# EAGLE design shm (EAGLE 6.4)
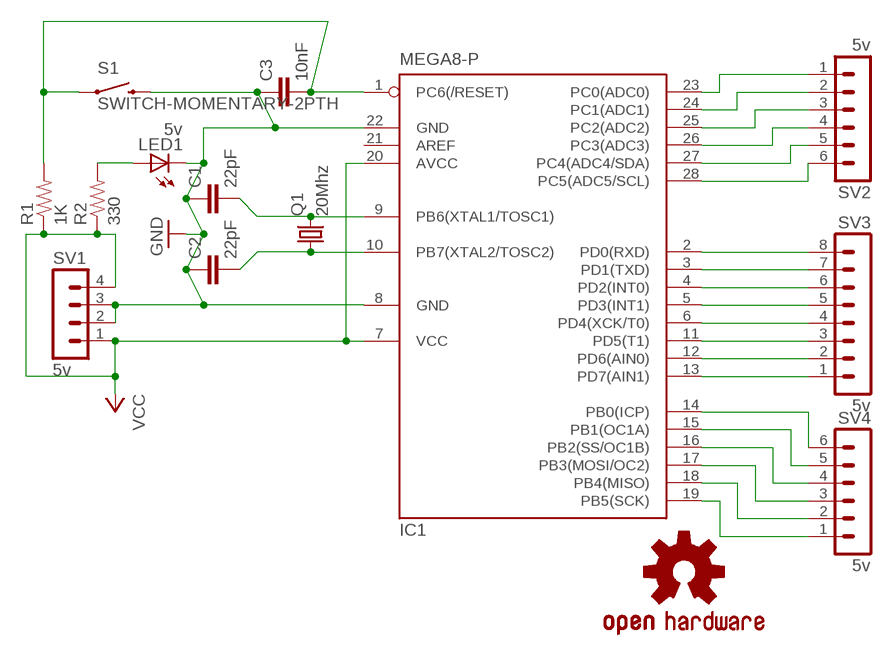
[diagram p0: schematic, sheet 1]

## Parts
C1  22pF  CAP0805  [0805]
C2  22pF  CAP0805  [0805]
C3  10nF  CAP0805  [0805]
IC1  MEGA8-P  [DIL28-3]
LED1  5v  LEDCHIPLED_0805  [CHIPLED_0805]
LOGO1  OSHW-LOGOL  [OSHW-LOGO-L]
Q1  20Mhz  CRYSTALSM49  [SM49]
R1  1K  RESISTOR0805-RES  [0805]
R2  330  RESISTOR0805-RES  [0805]
S1  SWITCH-MOMENTARY-2PTH  [TACTILE-PTH]
SV1  5v  MA04-1  [MA04-1]
SV2  5v  MA06-1  [MA06-1]
SV3  5v  MA08-1  [MA08-1]
SV4  5v  MA06-1  [MA06-1]

## Nets
GND: C1.1 C2.1 C3.1 IC1.8(GND) IC1.22(GND) LED1.C S1.3 SV1.2 SV1.3
N$1: IC1.2(PD0(RXD)) SV3.8
N$2: IC1.3(PD1(TXD)) SV3.7
N$3: IC1.4(PD2(INT0)) SV3.6
N$4: IC1.5(PD3(INT1)) SV3.5
N$5: IC1.6(PD4(XCK/T0)) SV3.4
N$6: IC1.11(PD5(T1)) SV3.3
N$7: IC1.12(PD6(AIN0)) SV3.2
N$8: IC1.13(PD7(AIN1)) SV3.1
N$9: IC1.14(PB0(ICP)) SV4.6
N$10: IC1.15(PB1(OC1A)) SV4.5
N$11: IC1.16(PB2(SS/OC1B)) SV4.4
N$12: IC1.17(PB3(MOSI/OC2)) SV4.3
N$13: IC1.18(PB4(MISO)) SV4.2
N$14: IC1.19(PB5(SCK)) SV4.1
N$15: IC1.28(PC5(ADC5/SCL)) SV2.6
N$16: IC1.27(PC4(ADC4/SDA)) SV2.5
N$17: IC1.26(PC3(ADC3)) SV2.4
N$18: IC1.25(PC2(ADC2)) SV2.3
N$19: IC1.24(PC1(ADC1)) SV2.2
N$20: IC1.23(PC0(ADC0)) SV2.1
N$21: C1.2 IC1.9(PB6(XTAL1/TOSC1)) Q1.2
N$22: LED1.A R2.2
N$23: C2.2 IC1.10(PB7(XTAL2/TOSC2)) Q1.1
N$24: C3.2 IC1.1(PC6(/RESET)) R1.2 S1.1
VCC: IC1.7(VCC) IC1.20(AVCC) R1.1 R2.1 SV1.1 SV1.4
Unconnected: IC1.21(AREF)

## Library data of the parts
C1-C3 = SparkFun-Capacitors:CAP: Capacitor Standard 0603 ceramic capacitor, and 0.1" leaded capacitor.
IC1 = atmel:MEGA8-P: MICROCONTROLLER 8 Kbytes FLASH, 1 kbytes SRAM, 512 bytes EEPROM, USART, 4-channel 10 bit ADC, 2-channel 8 bit ADC Pin compatible with Atmega48, ATMega88, ATMega168 Source: avr.lbr; OC_FARNELL: unknown; OC_NEWARK: unknown
LED1 = led:LED: LED OSRAM: - CHIPLED LG R971, LG N971, LY N971, LG Q971, LY Q971, LO R971, LY R971 LH N974, LH R974 LS Q976, LO Q976, LY Q976 LO Q996 - Hyper CHIPLED LW Q18S LB Q993, LB Q99A, LB R99A - SideLED LS A670, LO A670, LY A670, LG A670, LP A670 LB A673, LV A673, LT A673, LW A673 LH A674 LY A675 LS A676, LA A676, LO A676, LY A676, LW A676 LS A679, LY A679, LG A679 - Hyper Micro SIDELED® LS Y876, LA Y876, LO Y876, LY Y876 LT Y87S - SmartLED LW L88C, LW L88S LB L89C, LB L89S, LG L890 LS L89K, LO L89K, LY L89K LS L896, LA L896, LO L896, LY L896 - TOPLED LS T670, LO T670, LY T670, LG T670, LP T670 LSG T670, LSP T670, LSY T670, LOP T670, LYG T670 LG T671, LOG T671, LSG T671 LB T673, LV T673, LT T673, LW T673 LH T674 LS T676, LA T676, LO T676, LY T676, LB T676, LH T676, LSB T676, LW T676 LB T67C, LV T67C, LT T67C, LS T67K, LO T67K, LY T67K, LW E67C LS E67B, LA E67B, LO E67B, LY E67B, LB E67C, LV E67C, LT E67C LW T67C LS T679, LY T679, LG T679 LS T770, LO T770, LY T770, LG T770, LP T770 LB T773, LV T773, LT T773, LW T773 LH T774 LS E675, LA E675, LY E675, LS T675 LS T776, LA T776, LO T776, LY T776, LB T776 LHGB T686 LT T68C, LB T68C - Hyper Mini TOPLED® LB M676 - Mini TOPLED Santana® LG M470 LS M47K, LO M47K, LY M47K Source: http://www.osram.convergy.de LUXEON: - LUMILED® LXK2-PW12-R00, LXK2-PW12-S00, LXK2-PW14-U00, LXK2-PW14-V00 LXK2-PM12-R00, LXK2-PM12-S00, LXK2-PM14-U00 LXK2-PE12-Q00, LXK2-PE12-R00, LXK2-PE12-S00, LXK2-PE14-T00, LXK2-PE14-U00 LXK2-PB12-K00, LXK2-PB12-L00, LXK2-PB12-M00, LXK2-PB14-N00, LXK2-PB14-P00, LXK2-PB14-Q00 LXK2-PR12-L00, LXK2-PR12-M00, LXK2-PR14-Q00, LXK2-PR14-R00 LXK2-PD12-Q00, LXK2-PD12-R00, LXK2-PD12-S00 LXK2-PH12-R00, LXK2-PH12-S00 LXK2-PL12-P00, LXK2-PL12-Q00, LXK2-PL12-R00 Source: www.luxeon.com KINGBRIGHT: KA-3528ASYC Source: www.kingbright.com
LOGO1 = SparkFun-Aesthetics:OSHW-LOGO: Open Source Hardware Logo This logo indicates the piece of hardware it is found on incorporates a OSHW license and/or adheres to the definition of open source hardware found here: http://freedomdefined.org/OSHW
Q1 = crystal:CRYSTAL: CRYSTAL; OC_FARNELL: unknown; OC_NEWARK: unknown
R1 R2 = SparkFun-Passives:RESISTOR: Resistor Basic schematic elements and footprints for 0603, 1206, and PTH resistors.
S1 = SparkFun-Electromechanical:SWITCH-MOMENTARY-2: Various NO switches- pushbuttons, reed, etc
SV1 = con-lstb:MA04-1: PIN HEADER; OC_FARNELL: unknown; OC_NEWARK: unknown
SV2 SV4 = con-lstb:MA06-1: PIN HEADER; OC_FARNELL: unknown; OC_NEWARK: unknown
SV3 = con-lstb:MA08-1: PIN HEADER; OC_FARNELL: unknown; OC_NEWARK: unknown

## Board
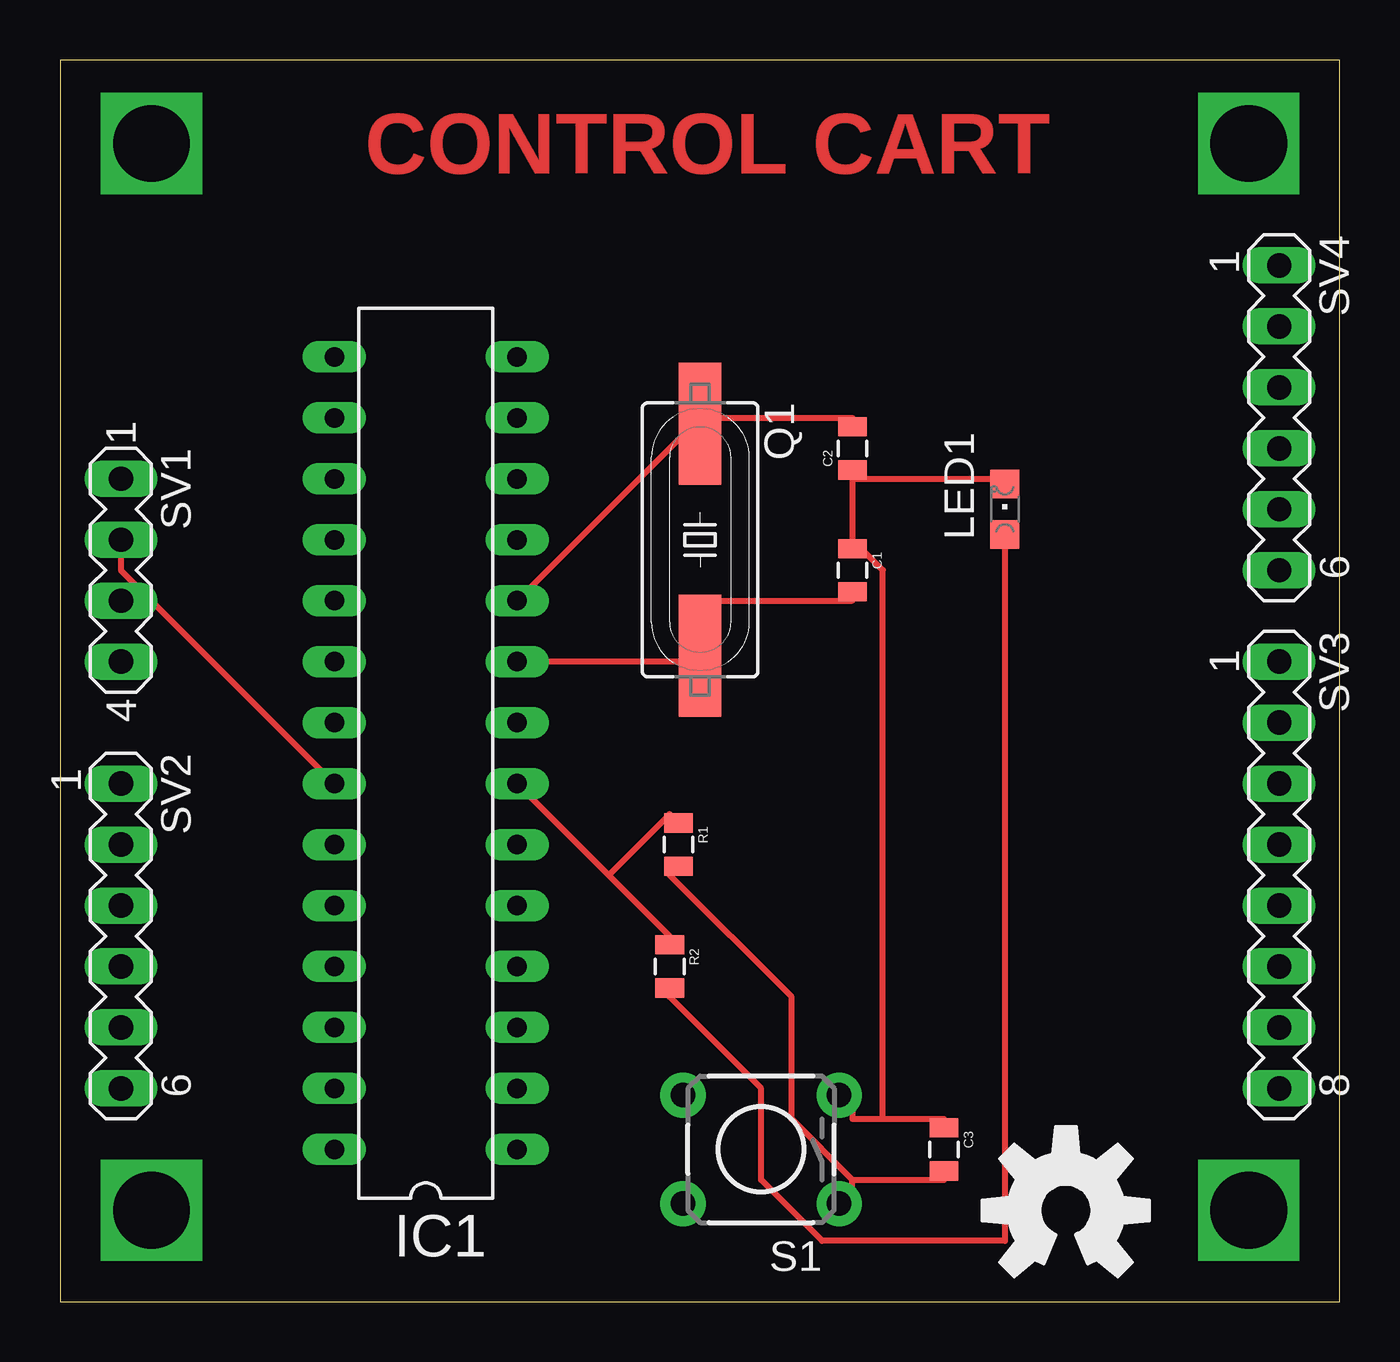
[diagram p1: board, top side]
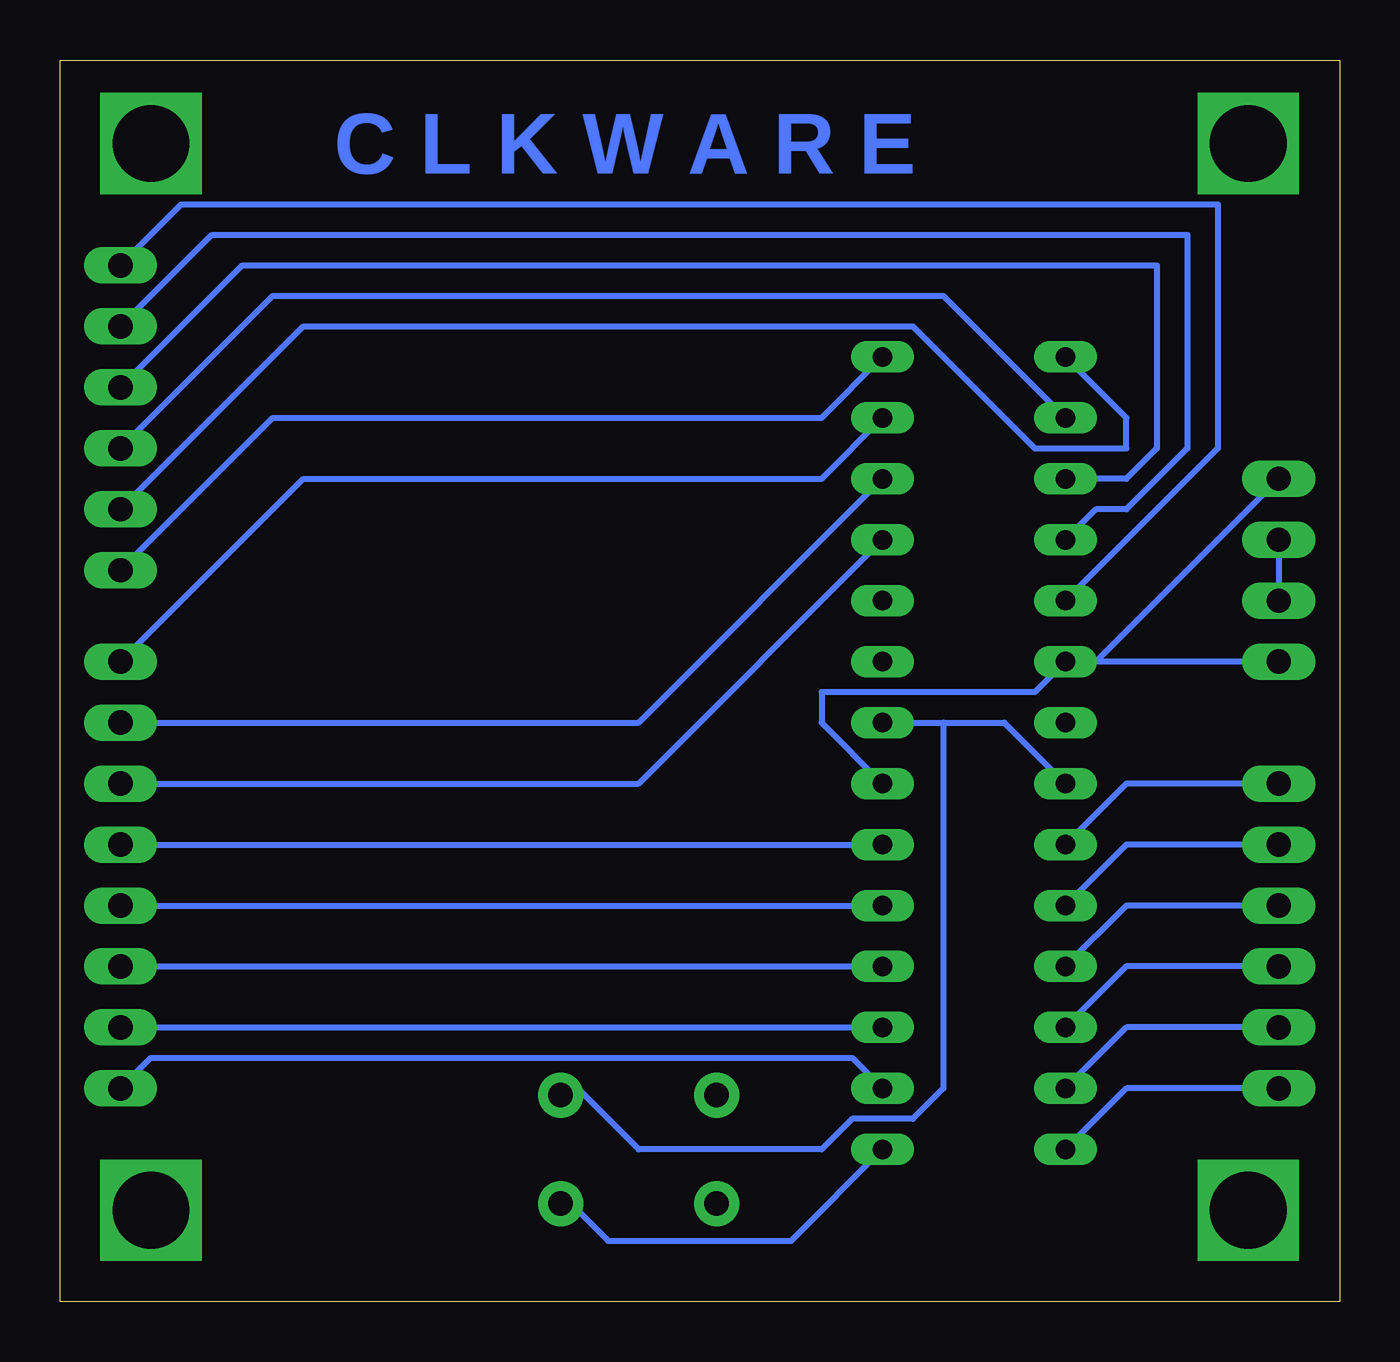
[diagram p2: board, bottom side, seen from below]

Size 53.32 x 51.74 mm. Coordinates in mm from the lower left corner, seen from the top.
Outline: 0,0 53.32,0 53.32,51.74 0,51.74 0,0
Copper layers (1*16): Top 0.035mm / dielectric 1.5mm / Bottom 0.035mm
Design rules "default": minimum track width 10mil, minimum drill 24mil, track to track 8mil, track to pad 8mil, pad to pad 8mil, via to via 8mil, smd to smd 8mil, copper to edge 40mil, drill to drill 8mil, minimum pad ring 10mil, minimum via ring 8mil, stop-mask expansion 4mil, vias tented up to drill 0mil, thermal gap 10mil

### Footprints (pad centres in the part's own frame; a part is rotated, then mirrored left to right if it is on the bottom)
0805 = smd 0.8 x 1.2: 1 -0.9,0; 2 0.9,0
DIL28-3 = drill 0.813 long: 1 -16.51,-3.81; 2 -13.97,-3.81; 3 -11.43,-3.81; 4 -8.89,-3.81; 5 -6.35,-3.81; 6 -3.81,-3.81; 7 -1.27,-3.81; 8 1.27,-3.81; 9 3.81,-3.81; 10 6.35,-3.81; 11 8.89,-3.81; 12 11.43,-3.81; 13 13.97,-3.81; 14 16.51,-3.81; 15 16.51,3.81; 16 13.97,3.81; 17 11.43,3.81; 18 8.89,3.81; 19 6.35,3.81; 20 3.81,3.81; 21 1.27,3.81; 22 -1.27,3.81; 23 -3.81,3.81; 24 -6.35,3.81; 25 -8.89,3.81; 26 -11.43,3.81; 27 -13.97,3.81; 28 -16.51,3.81
CHIPLED_0805 = smd 1.2 x 1.2: A 0,-1.05; C 0,1.05
SM49 = smd 5.08 x 1.778: 1 -4.826,0; 2 4.826,0
TACTILE-PTH = drill 1.016 pad 1.88: 1 -3.251,2.261; 2 3.251,2.261; 3 -3.251,-2.261; 4 3.251,-2.261
MA04-1 = drill 1.016 long: 1 -3.81,0; 2 -1.27,0; 3 1.27,0; 4 3.81,0
MA06-1 = drill 1.016 long: 1 -6.35,0; 2 -3.81,0; 3 -1.27,0; 4 1.27,0; 5 3.81,0; 6 6.35,0
MA08-1 = drill 1.016 long: 1 -8.89,0; 2 -6.35,0; 3 -3.81,0; 4 -1.27,0; 5 1.27,0; 6 3.81,0; 7 6.35,0; 8 8.89,0

### Placement (x,y rotation side)
C1  33.02,30.48 270 top
C2  33.02,35.56 90 top
C3  36.83,6.35 270 top
IC1  15.24,22.86 90 top
LED1  39.37,33.02 0 top
LOGO1  41.91,3.81 0 top
Q1  26.67,31.75 270 top
R1  25.77,19.05 270 top
R2  25.4,13.97 270 top
S1  29.21,6.35 180 top
SV1  2.54,30.48 270 top
SV2  2.54,15.24 270 top
SV3  50.8,17.78 270 top
SV4  50.8,36.83 270 top

### Tracks (layer width: path | path; a pad name or v marks a point on that pad's centre or on a via)
GND
  Top 0.254: 33.02,34.29 33.02,31.75 | 33.02,34.29 39.37,34.29 LED1.C | 33.02,34.29 C2.1 | 34.29,7.62 33.02,7.62 33.02,8.89 S1.3 | 34.29,7.62 36.83,7.62 C3.1 | IC1.22 2.54,30.48 SV1.2 | 33.02,31.75 34.29,30.48 34.29,7.62 | 33.02,31.75 C1.1
  Bottom 0.254: SV1.2 SV1.3 | IC1.22 13.97,24.13 16.51,24.13 | IC1.8 16.51,24.13 | 16.51,24.13 16.51,8.89 17.78,7.62 20.32,7.62 21.59,6.35 29.21,6.35 31.75,8.89 S1.3
N$1
  Bottom 0.254: IC1.2 20.32,10.16 49.53,10.16 SV3.8
N$2
  Bottom 0.254: SV3.7 IC1.3
N$3
  Bottom 0.254: SV3.6 IC1.4
N$4
  Bottom 0.254: SV3.5 IC1.5
N$5
  Bottom 0.254: SV3.4 IC1.6
N$6
  Bottom 0.254: IC1.11 29.21,21.59 SV3.3
N$7
  Bottom 0.254: IC1.12 29.21,24.13 SV3.2
N$8
  Bottom 0.254: IC1.13 21.59,34.29 43.18,34.29 SV3.1
N$9
  Bottom 0.254: IC1.14 21.59,36.83 44.45,36.83 SV4.6
N$10
  Bottom 0.254: IC1.15 8.89,36.83 8.89,35.56 12.7,35.56 17.78,40.64 43.18,40.64 SV4.5
N$11
  Bottom 0.254: IC1.16 16.51,41.91 44.45,41.91 SV4.4
N$12
  Bottom 0.254: IC1.17 8.89,34.29 7.62,35.56 7.62,43.18 45.72,43.18 SV4.3
N$13
  Bottom 0.254: IC1.18 10.16,33.02 8.89,33.02 6.35,35.56 6.35,44.45 46.99,44.45 SV4.2
N$14
  Bottom 0.254: IC1.19 5.08,35.56 5.08,45.72 48.26,45.72 SV4.1
N$15
  Bottom 0.254: IC1.28 8.89,8.89 SV2.6
N$16
  Bottom 0.254: IC1.27 8.89,11.43 SV2.5
N$17
  Bottom 0.254: IC1.26 8.89,13.97 SV2.4
N$18
  Bottom 0.254: IC1.25 8.89,16.51 SV2.3
N$19
  Bottom 0.254: IC1.24 8.89,19.05 SV2.2
N$20
  Bottom 0.254: IC1.23 8.89,21.59 SV2.1
N$21
  Top 0.254: C1.2 33.02,29.21 26.67,29.21 Q1.2 26.67,26.67 IC1.9
N$22
  Top 0.254: LED1.A 39.37,2.54 31.75,2.54 29.21,5.08 29.21,8.89 25.4,12.7 R2.2
N$23
  Top 0.254: 26.67,36.83 33.02,36.83 C2.2 | 26.67,36.83 IC1.10 | 26.67,36.83 Q1.1
N$24
  Top 0.254: 33.02,5.08 36.83,5.08 C3.2 | 33.02,5.08 33.02,3.81 S1.1 | 33.02,5.08 30.48,7.62 30.48,12.7 25.4,17.78 R1.2
  Bottom 0.254: IC1.1 22.86,2.54 30.48,2.54 31.75,3.81 S1.1
N$26  (via drill 3.2)
  other vias: 49.53,48.26
N$27  (via drill 3.2)
  other vias: 49.53,3.81
N$28  (via drill 3.2)
  other vias: 3.81,3.81
N$29  (via drill 3.2)
  other vias: 3.81,48.26
VCC
  Top 0.254: IC1.7 22.86,17.78 | 22.86,17.78 25.4,15.24 R2.1 | 22.86,17.78 25.4,20.32 R1.1
  Bottom 0.254: SV1.4 10.16,26.67 | IC1.7 21.59,24.13 21.59,25.4 12.7,25.4 IC1.20 10.16,26.67 | 10.16,26.67 SV1.1

### Text on the board
Top: CONTROL CART
Bottom: C L K W A R E